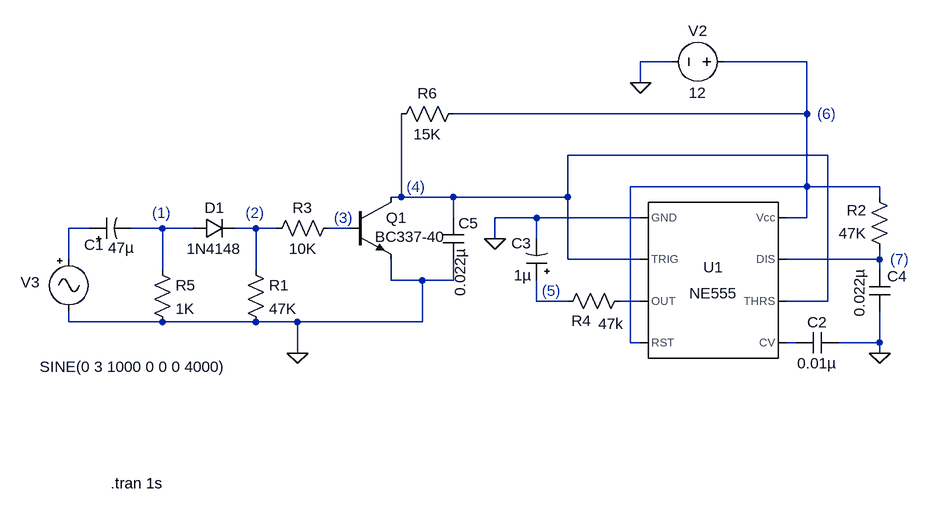
[diagram p0: schematic Draft1.asc]
Draft1.asc, the LTspice schematic file:
Version 4
SHEET 1 1116 952
WIRE 480 -48 432 -48
WIRE 688 -48 560 -48
WIRE 432 -16 432 -48
WIRE 688 32 688 -48
WIRE 688 32 144 32
WIRE 720 96 320 96
WIRE 688 144 688 32
WIRE 688 144 416 144
WIRE 800 144 688 144
WIRE 64 160 64 32
WIRE 64 160 48 160
WIRE 144 160 64 160
WIRE 320 160 320 96
WIRE 320 160 144 160
WIRE 800 160 800 144
WIRE 144 192 144 160
WIRE 272 192 208 192
WIRE 432 192 272 192
WIRE 688 192 688 144
WIRE 688 192 656 192
WIRE -416 208 -448 208
WIRE -304 208 -352 208
WIRE -256 208 -304 208
WIRE -160 208 -192 208
WIRE -128 208 -160 208
WIRE -16 208 -48 208
WIRE 208 224 208 192
WIRE 272 224 272 192
WIRE -448 256 -448 208
WIRE 320 256 320 160
WIRE 432 256 320 256
WIRE 800 256 800 240
WIRE 800 256 656 256
WIRE -304 272 -304 208
WIRE -160 272 -160 208
WIRE 800 272 800 256
WIRE 48 288 48 256
WIRE 96 288 48 288
WIRE 144 288 144 256
WIRE 144 288 96 288
WIRE 272 320 272 288
WIRE 320 320 272 320
WIRE 432 320 400 320
WIRE 720 320 720 96
WIRE 720 320 656 320
WIRE -448 352 -448 336
WIRE -304 352 -448 352
WIRE -160 352 -304 352
WIRE -96 352 -160 352
WIRE 96 352 96 288
WIRE 96 352 -96 352
WIRE 416 384 416 144
WIRE 432 384 416 384
WIRE 672 384 656 384
WIRE 800 384 800 336
WIRE 800 384 736 384
WIRE -96 400 -96 352
WIRE 800 400 800 384
FLAG 208 224 0
FLAG 800 400 0
FLAG -96 400 0
FLAG 432 -16 0
SYMBOL /Misc/NE555 544 288 R0
SYMATTR InstName U1
SYMBOL /npn -16 160 R0
WINDOW 3 39 61 Left 2
SYMATTR Value BC337-40
SYMATTR InstName Q1
SYMBOL /res -176 256 R0
SYMATTR InstName R1
SYMATTR Value 47K
SYMBOL /diode -256 224 R270
WINDOW 0 32 32 VTop 2
WINDOW 3 0 32 VBottom 2
SYMATTR InstName D1
SYMATTR Value 1N4148
SYMBOL /res 816 256 R180
WINDOW 0 36 76 Left 2
WINDOW 3 36 40 Left 2
SYMATTR InstName R2
SYMATTR Value 47K
SYMBOL /res -32 192 R90
WINDOW 0 0 56 VBottom 2
WINDOW 3 32 56 VTop 2
SYMATTR InstName R3
SYMATTR Value 10K
SYMBOL /res 416 304 R90
WINDOW 0 62 75 VBottom 2
WINDOW 3 35 29 VTop 2
SYMATTR InstName R4
SYMATTR Value 47k
SYMBOL /res -320 256 R0
SYMATTR InstName R5
SYMATTR Value 1K
SYMBOL /res 160 16 R90
WINDOW 0 0 56 VBottom 2
WINDOW 3 32 56 VTop 2
SYMATTR InstName R6
SYMATTR Value 15K
SYMBOL /cap 736 368 R90
WINDOW 0 0 32 VBottom 2
WINDOW 3 32 32 VTop 2
SYMATTR InstName C2
SYMATTR Value 0.01µ
SYMBOL /cap 784 272 R0
WINDOW 0 28 10 Left 2
WINDOW 3 -15 -2 VRight 2
SYMATTR InstName C4
SYMATTR Value 0.022µ
SYMBOL /cap 128 192 R0
WINDOW 3 26 47 VRight 2
SYMATTR Value 0.022µ
SYMATTR InstName C5
SYMBOL /voltage 576 -48 R90
WINDOW 0 -32 56 VBottom 2
WINDOW 3 32 56 VTop 2
SYMATTR InstName V2
SYMATTR Value 12
SYMBOL /polcap -416 224 R270
WINDOW 0 -25 7 VTop 2
WINDOW 3 2 49 VBottom 2
SYMATTR InstName C1
SYMATTR Value 47µ
SYMBOL /Misc/signal -448 240 R0
WINDOW 3 -45 181 Left 2
WINDOW 0 -74 51 Left 2
SYMATTR Value SINE(0 3 1000 0 0 0 4000)
SYMATTR InstName V3
SYMBOL /polcap 288 288 R180
WINDOW 0 24 57 Left 2
WINDOW 3 24 8 Left 2
SYMATTR InstName C3
SYMATTR Value 1µ
TEXT -384 600 Left 2 !.tran 1s
TEXT -320 184 Left 2 ;(1)
TEXT -176 184 Left 2 ;(2)
TEXT -40 192 Left 2 ;(3)
TEXT 72 144 Left 2 ;(4)
TEXT 280 304 Left 2 ;(5)
TEXT 704 32 Left 2 ;(6)
TEXT 816 256 Left 2 ;(7)

The netlist it stands for:
* Draft1.asc
XU1 0 N002 N009 N001 N010 N002 N007 N001 NE555  ; pins GND TRIG OUT RST CV THRS DIS Vcc
Q1 N002 N006 0 0 BC337-40
R1 N005 0 47K
D1 N004 N005 1N4148
R2 N007 N001 47K
R3 N006 N005 10K
R4 N009 N008 47k
R5 N004 0 1K
R6 N001 N002 15K
C2 0 N010 0.01µ
C4 N007 0 0.022µ
C5 N002 0 0.022µ
V2 N001 0 12
C1 N003 N004 47µ
V3 N003 0 SINE(0 3 1000 0 0 0 4000)
C3 N008 0 1µ
.model D D
.lib standard.dio
.model NPN NPN
.model PNP PNP
.lib standard.bjt
.tran 1s
* (1)
* (2)
* (3)
* (4)
* (5)
* (6)
* (7)
.lib NE555.sub
.backanno
.end